# EAGLE design CarelessWISPer_alphaPCB (EAGLE 9.6.2)

## Sheet 1 of 2
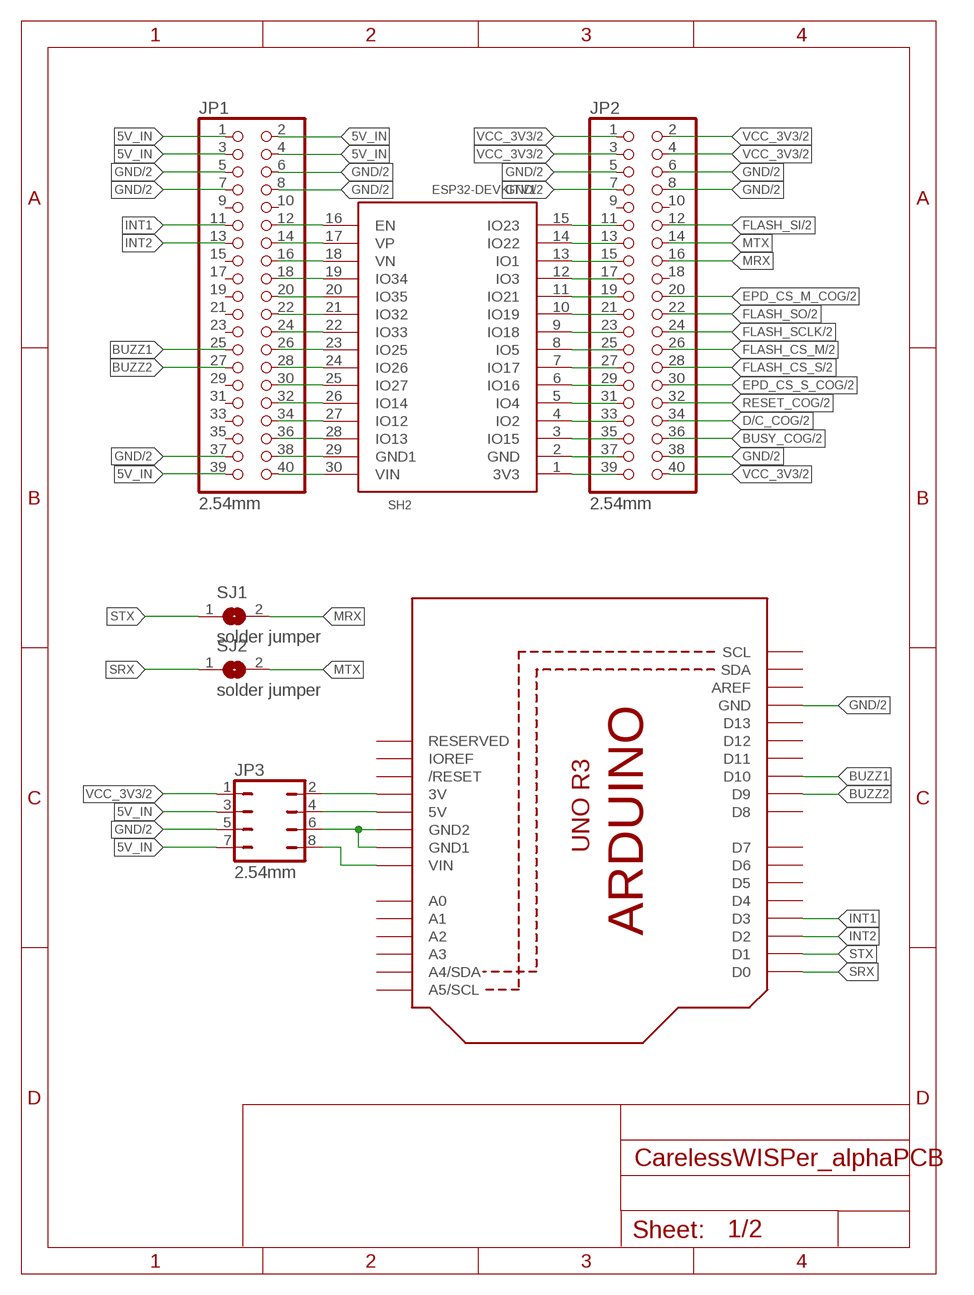
[diagram p0: schematic, sheet 1]

### Parts
JP1  2.54mm  PINHD-2X20  [2X20]
JP2  2.54mm  PINHD-2X20  [2X20]
JP3  2.54mm  JP4Q  [JP4Q]
SH1  ARDUINOR3-BPLACE  [ARDUINOR3-BPLACE]
SH2  ESP32-DEVKIT1_FIX  [ESP32-DEVKITV1]
SJ1  solder jumper  SJ  [SJ]
SJ2  solder jumper  SJ  [SJ]

### Nets
3V [power]: JP3.2 SH1.3V
5V [power]: JP3.4 SH1.5V
5V_IN [power]: JP1.1 JP1.2 JP1.3 JP1.4 JP1.39 JP3.3 JP3.7
BUSY_COG: JP2.36 ; also sheet 2
BUZZ1: JP1.25 SH1.D10
BUZZ2: JP1.27 SH1.D9
D/C_COG: JP2.34 ; also sheet 2
EPD_CS_M_COG: JP2.20 ; also sheet 2
EPD_CS_S_COG: JP2.30 ; also sheet 2
FLASH_CS_M: JP2.26 ; also sheet 2
FLASH_CS_S: JP2.28 ; also sheet 2
FLASH_SCLK: JP2.24 ; also sheet 2
FLASH_SI: JP2.12 ; also sheet 2
FLASH_SO: JP2.22 ; also sheet 2
GND [power]: JP1.5 JP1.6 JP1.7 JP1.8 JP1.37 JP2.5 JP2.6 JP2.7 JP2.8 JP2.38 JP3.5 SH1.GND ; also sheet 2
GND1 [power]: JP1.38 SH2.29(GND1)
GND2 [power]: JP3.6 SH1.GND1 SH1.GND2
INT1: JP1.11 SH1.D3
INT2: JP1.13 SH1.D2
IO1: JP2.15 SH2.13(IO1)
IO2: JP2.33 SH2.4(IO2)
IO3: JP2.17 SH2.12(IO3)
IO3V3 [power]: JP2.39 SH2.1(3V3)
IO4: JP2.31 SH2.5(IO4)
IO5: JP2.25 SH2.8(IO5)
IO12: JP1.34 SH2.27(IO12)
IO13: JP1.36 SH2.28(IO13)
IO14: JP1.32 SH2.26(IO14)
IO15: JP2.35 SH2.3(IO15)
IO16: JP2.29 SH2.6(IO16)
IO17: JP2.27 SH2.7(IO17)
IO18: JP2.23 SH2.9(IO18)
IO19: JP2.21 SH2.10(IO19)
IO21: JP2.19 SH2.11(IO21)
IO22: JP2.13 SH2.14(IO22)
IO23: JP2.11 SH2.15(IO23)
IO25: JP1.26 SH2.23(IO25)
IO26: JP1.28 SH2.24(IO26)
IO27: JP1.30 SH2.25(IO27)
IO32: JP1.22 SH2.21(IO32)
IO33: JP1.24 SH2.22(IO33)
IO34: JP1.18 SH2.19(IO34)
IO35: JP1.20 SH2.20(IO35)
IOEN: JP1.12 SH2.16(EN)
IOGND [power]: JP2.37 SH2.2(GND)
IOVIN [power]: JP1.40 SH2.30(VIN)
IOVN: JP1.16 SH2.18(VN)
IOVP: JP1.14 SH2.17(VP)
MRX: JP2.16 SJ1.2
MTX: JP2.14 SJ2.2
RESET_COG: JP2.32 ; also sheet 2
SRX: SH1.D0 SJ2.1
STX: SH1.D1 SJ1.1
VCC_3V3 [power]: JP2.1 JP2.2 JP2.3 JP2.4 JP2.40 JP3.1 ; also sheet 2
VIN [power]: JP3.8 SH1.VIN
Unconnected: JP1.9 JP1.10 JP1.15 JP1.17 JP1.19 JP1.21 JP1.23 JP1.29 JP1.31 JP1.33 JP1.35 JP2.9 JP2.10 JP2.18 SH1.A0 SH1.A1 SH1.A2 SH1.A3 SH1.A4(A4/SDA) SH1.A5(A5/SCL) SH1.AREF SH1.D4 SH1.D5 SH1.D6 SH1.D7 SH1.D8 SH1.D11 SH1.D12 SH1.D13 SH1.IOREF SH1.RESERVED SH1.RESET(/RESET) SH1.SCL SH1.SDA

## Sheet 2 of 2
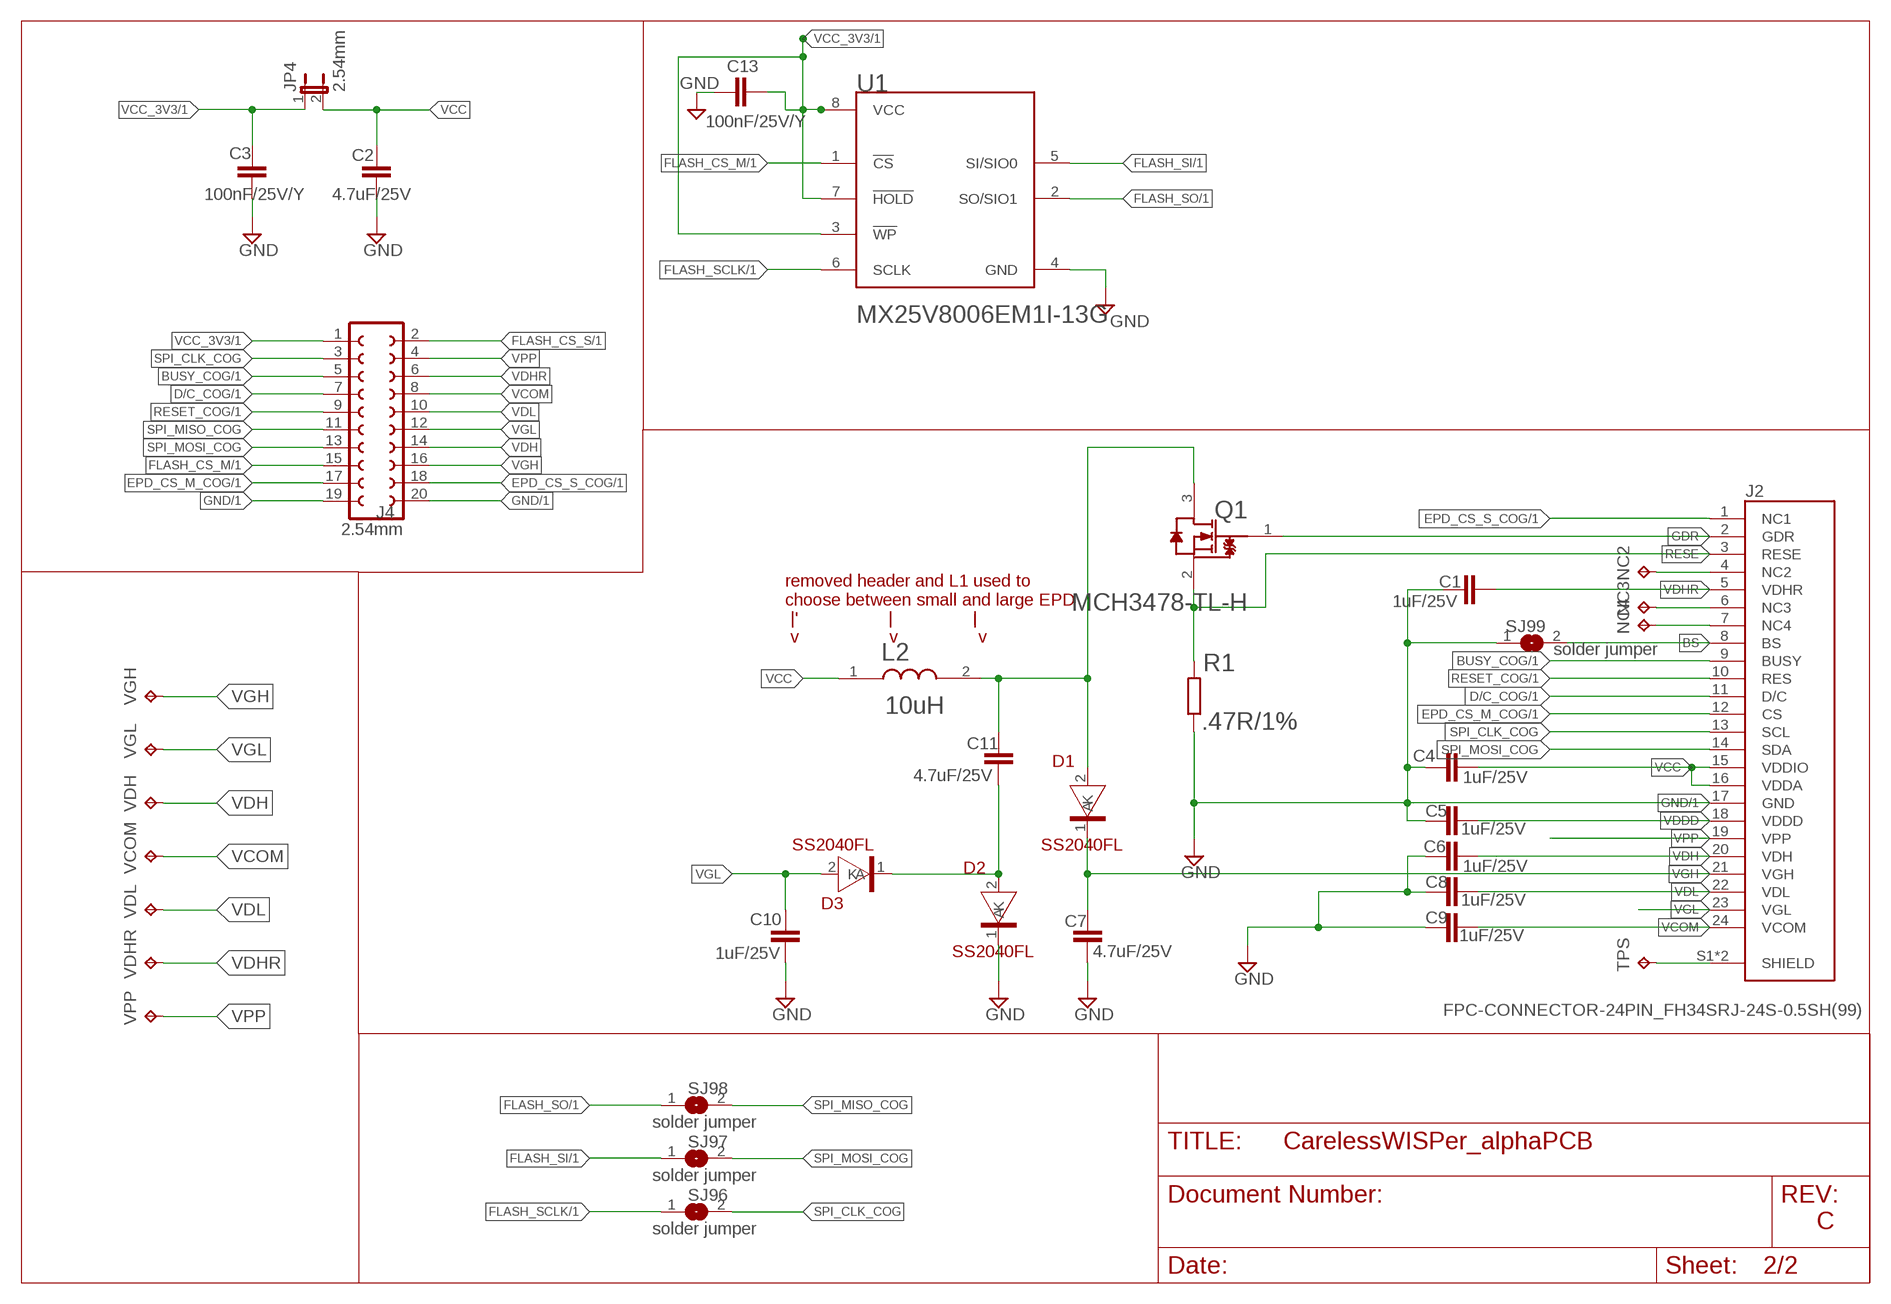
[diagram p1: schematic, sheet 2]

### Parts
C1  1uF/25V  C_CHIP-0805(2012-METRIC)  [CAPC2012X110]
C2  4.7uF/25V  C_CHIP-0805(2012-METRIC)  [CAPC2012X110]
C3  100nF/25V/Y  C_CHIP-0805(2012-METRIC)  [CAPC2012X110]
C4  1uF/25V  C_CHIP-0805(2012-METRIC)  [CAPC2012X110]
C5  1uF/25V  C_CHIP-0805(2012-METRIC)  [CAPC2012X110]
C6  1uF/25V  C_CHIP-0805(2012-METRIC)  [CAPC2012X110]
C7  4.7uF/25V  C_CHIP-0805(2012-METRIC)  [CAPC2012X110]
C8  1uF/25V  C_CHIP-0805(2012-METRIC)  [CAPC2012X110]
C9  1uF/25V  C_CHIP-0805(2012-METRIC)  [CAPC2012X110]
C10  1uF/25V  C_CHIP-0805(2012-METRIC)  [CAPC2012X110]
C11  4.7uF/25V  C_CHIP-0805(2012-METRIC)  [CAPC2012X110]
C13  100nF/25V/Y  C_CHIP-0805(2012-METRIC)  [CAPC2012X110]
D1  SS2040FL  [SOD-123FL]
D2  SS2040FL  [SOD-123FL]
D3  SS2040FL  [SOD-123FL]
J2  FPC-CONNECTOR-24PIN_FH34SRJ-24S-0.5SH(99)  [FPC-CONNECTOR-24PIN_HRS_FH34SRJ-24S-0.5SH(99)]
J4  2.54mm  FE10-2W  [FE10-2W]
JP4  2.54mm  JP1E  [JP1]
L2  MURATA_LQH3NPZ100MMELMURATA_LQH3NPZ100MMEL_0_0  [MURATA_LQH3NPZ100MMEL_0]
NC2  TPB1,27  [B1,27]
NC3  TPB1,27  [B1,27]
NC4  TPB1,27  [B1,27]
Q1  ON_SEMICONDUCTOR_MCH3478-TL-HON_SEMICONDUCTOR_MCH3478-TL-H_0_0  [ON_SEMICONDUCTOR_MCH3478-TL-H_0]
R1  .47R/1%  R_CHIP-0805(2012-METRIC)  [RESC2012X65]
SJ96  solder jumper  SJ  [SJ]
SJ97  solder jumper  SJ  [SJ]
SJ98  solder jumper  SJ  [SJ]
SJ99  solder jumper  SJ  [SJ]
TPS  TPB1,27  [B1,27]
U1  MACRONIX_MX25V8006EM1I-13GMACRONIX_MX25V8006EM1I-13G_0_0  [MACRONIX_MX25V8006EM1I-13G_0]
VCOM  TPB1,27  [B1,27]
VDH  TPB1,27  [B1,27]
VDHR  TPB1,27  [B1,27]
VDL  TPB1,27  [B1,27]
VGH  TPB1,27  [B1,27]
VGL  TPB1,27  [B1,27]
VPP  TPB1,27  [B1,27]

### Nets
BS: J2.8(BS) SJ99.2
BUSY_COG: J2.9(BUSY) J4.5 ; also sheet 1
D/C_COG: J2.11(D/C) J4.7 ; also sheet 1
DIODE_JUNCT: C11.1 D2.2(A) D3.1(K)
EPD_CS_M_COG: J2.12(CS) J4.17 ; also sheet 1
EPD_CS_S_COG: J2.1(NC1) J4.18 ; also sheet 1
FLASH_CS_M: J4.15 U1.1(!CS!) ; also sheet 1
FLASH_CS_S: J4.2 ; also sheet 1
FLASH_SCLK: SJ96.1 U1.6(SCLK) ; also sheet 1
FLASH_SI: SJ97.1 U1.5(SI/SIO0) ; also sheet 1
FLASH_SO: SJ98.1 U1.2(SO/SIO1) ; also sheet 1
GDR [power]: J2.2(GDR) Q1.1(G)
GND [power]: C1.1 C2.1 C3.1 C4.2 C5.2 C6.2 C7.1 C8.2 C9.2 C10.2 C13.1 D2.1(K) J2.17(GND) J4.19 J4.20 R1.1 SJ99.1 U1.4(GND) ; also sheet 1
L2-Q1 [power]: C11.2 D1.2(A) L2.2 Q1.3(D)
NC1: J2.S1(SHIELD) J2.S2(SHIELD) TPS.TP
NC2: J2.4(NC2) NC2.TP
NC3: J2.6(NC3) NC3.TP
NC4: J2.7(NC4) NC4.TP
RESE: J2.3(RESE) Q1.2(S) R1.2
RESET_COG: J2.10(RES) J4.9 ; also sheet 1
SPI_CLK_COG: J2.13(SCL) J4.3 SJ96.2
SPI_MISO_COG: J4.11 SJ98.2
SPI_MOSI_COG: J2.14(SDA) J4.13 SJ97.2
VCC [power]: C2.2 C4.1 J2.15(VDDIO) J2.16(VDDA) JP4.2 L2.1
VCC_3V3 [power]: C3.2 C13.2 J4.1 JP4.1 U1.3(!WP!) U1.7(!HOLD!) U1.8(VCC) ; also sheet 1
VCOM [power]: C9.1 J2.24(VCOM) J4.8 VCOM.TP
VDDD [power]: C5.1 J2.18(VDDD)
VDH [power]: C6.1 J2.20(VDH) J4.14 VDH.TP
VDHR [power]: C1.2 J2.5(VDHR) J4.6 VDHR.TP
VDL [power]: C8.1 J2.22(VDL) J4.10 VDL.TP
VGH [power]: C7.2 D1.1(K) J2.21(VGH) J4.16 VGH.TP
VGL [power]: C10.1 D3.2(A) J2.23(VGL) J4.12 VGL.TP
VPP [power]: J2.19(VPP) J4.4 VPP.TP

### Notes on the sheet
- removed header and L1 used to 
  choose between small and large EPD
   |'                  |                |
   v                  v                v
- C

## Library data of the parts
C1-C11 C13 = Capacitor:C: Capacitor - Generic; CATEGORY: Capacitor
D1-D3 = DIODE:SS2040FL: Check prices <https://pricing.snapeda.com/parts/SS2040FL/Panjit/view-part?ref=eda>; AVAILABILITY: In Stock; DESCRIPTION: Schottky Diodes & Rectifiers GP/TR/13/RoHS/10K/SOD-123FL/SKY/SOD/SSM-20AAFL/SSM20FL-QI02/PJ///; MF: Panjit; MP: SS2040FL; PACKAGE: None; PRICE: None; PURCHASE-URL: https://pricing.snapeda.com/search/part/SS2040FL/?ref=eda
J2 = ESL:FPC-CONNECTOR-24PIN_FH34SRJ-24S-0.5SH(99): FFC & FPC Connectors Check prices <https://pricing.snapeda.com/parts/FH34SRJ-24S-0.5SH%2899%29/Hirose%20Electric/view-part?ref=eda>; AVAILABILITY: In Stock; DESCRIPTION: 24 Position FFC, FPC Connector Contacts, Top and Bottom 0.020 (0.50mm) Surface Mount, Right Angle; MF: Hirose Electric; MP: FH34SRJ-24S-0.5SH(99); PACKAGE: None; PRICE: None; PURCHASE-URL: https://pricing.snapeda.com/search/part/FH34SRJ-24S-0.5SH(99)/?ref=eda
J4 = con-lsta:FE10-2W: FEMALE HEADER; OC_FARNELL: unknown; OC_NEWARK: unknown
JP1 JP2 = pinhead:PINHD-2X20: PIN HEADER
JP3 = jumper:JP4Q: JUMPER
JP4 = jumper:JP1E: JUMPER
L2 = IND 10uH:MURATA_LQH3NPZ100MMEL: Wire Wound Ferrite Inductor for Power Lines For Automotive 10μH ±20% 0.228Ω 1280mA 1212; AMBIENT_TEMPERATURE_RANGE_HIGH: +105°C; AMBIENT_TEMPERATURE_RANGE_LOW: -40°C; AUTOMOTIVE: Yes; AUTOMOTIVE_GRADE: Grade 1; CENTROID_NOT_SPECIFIED: No; COMPOSITION: Wirewound; CORE_MATERIAL: Ferrite; DATASHEET: https://www.murata.com/en-us/products/productdetail?partno=LQH3NPZ100MME%23; DEVICE_CLASS_L1: Passive Components; DEVICE_CLASS_L2: Inductors; DEVICE_CLASS_L3: Fixed Inductors; FOOTPRINT_VARIANT_NAME_0: Recommended_Land_Pattern; HEIGHT: 1.5mm; INDUCTANCE: 10uH; LEAD_FREE: Yes; MF: Murata; MFG_PACKAGE_IDENT: LQH3NPH_ME; MFG_PACKAGE_IDENT_COMPONENT_ID: a63315cd171c542c; MFG_PACKAGE_IDENT_DATE: 0; MFG_PACKAGE_IDENT_REV: 0; MPN: LQH3NPZ100MMEL; PACKAGE: 1212.0; PREFIX: L; RMS_CURRENT: 1280mA; ROHS: Yes; SATURATION_CURRENT: 810mA; SELF_RESONANT_FREQUENCY: 20MHz; SERIES_RESISTANCE: 0.228Ω; SHIELDING: true; TEMPERATURE_RANGE_HIGH: +125°C; TEMPERATURE_RANGE_LOW: -40°C; TEST_FREQUENCY: 1MHz; TOLERANCE: 0.2; VERIFICATION_VERSION: 0.0.0.3
NC2-NC4 TPS VCOM VDH VDHR VDL VGH VGL VPP = testpad:TP: Test pad
Q1 = MOSFET:ON_SEMICONDUCTOR_MCH3478-TL-H: ONSC-NMOS-G1S2D3-3_J; CHANNEL_POLARITY: N Channel; CIIVA_IDS: 837008; CISS_TYP_PF: 130; COMPONENT_LINK_1_DESCRIPTION: Manufacturer URL; COMPONENT_LINK_1_URL: http://www.onsemi.com/; COMPONENT_LINK_3_DESCRIPTION: Package Specification; COMPONENT_LINK_3_URL: http://www.onsemi.com/pub_link/Collateral/EN7354-D.PDF; CONFIGURATION: Single; COSS_TYP_PF: 21; CRSS_TYP_PF: 14; DATASHEET: http://www.onsemi.cn/pub_link/Collateral/ENAA1353-D.PDF; FOOTPRINT_VARIANT_NAME_0: Manufacturer Recommended; IMPORTED: yes; IMPORTED_FROM: vault; IMPORT_TS: 1521851194; MF: On Semiconductor; MOUNTING_TECHNOLOGY: Surface Mount; MPN: MCH3478-TL-H; PACKAGE: MCPH-3; PACKAGE_DESCRIPTION: 3-Pin Small Outline Transistor, Body 2 x 1.6 mm, Pitch 0.65 mm; PACKAGE_TYPE: SC-70FL / MCPH-3; PACKING: Tape and Reel; PREFIX: Q; RELEASE_DATE: 1407149804; ROHS: No; VAULT_GUID: 93CF8D5F-116E-4A84-9C4D-567819B75567; VAULT_REVISION: 4F433114-B412-42D1-93FA-4D10C81BF666; VBRDSS_MIN_V: 30; VGSTH_MAX_V: 1.3; VGS_MAX_V: 12
R1 = Resistor:R: Resistor Fixed - Generic; CATEGORY: Resistor; SUB-CATEGORY: Fixed
SH1 = adafruit:ARDUINOR3: This is a new object for the new Arduino R3 - with extra pins that you may want to use (such as IOref, and duplicated A4/A5
SH2 = ESP32-DEVKITV1_fix:ESP32-DEVKIT1_FIX
SJ1 SJ2 SJ96-SJ99 = jumper:SJ: SMD solder JUMPER
U1 = Flash Memory:MACRONIX_MX25V8006EM1I-13G: FLASH - NOR Memory IC 8Mb (1M x 8) SPI 75MHz 8-SOP; 3DS_PART_NUMBER: 521-00003; ACCESS_TIME: 9us; AMBIENT_TEMPERATURE_RANGE_HIGH: +85°C; AMBIENT_TEMPERATURE_RANGE_LOW: -40°C; CENTROID_NOT_SPECIFIED: No; DATASHEET: https://media.digikey.com/pdf/Data%20Sheets/Macronix/MX25V8006E.pdf; DEVICE_CLASS_L1: Integrated Circuits (ICs); DEVICE_CLASS_L2: Memory; DEVICE_CLASS_L3: Flash; DIGIKEY_DESCRIPTION: IC FLASH 8MBIT 75MHZ 8SOP; DIGIKEY_PART_NUMBER: 1092-1118-ND; FOOTPRINT_PARAMETERS_0: {"fp_type":"SOIC_mini","params":{"N":{"nom":8,"long name":"Number of leads","min":null,"max":null,"short name":"N","type":"count"},"A":{"nom":false,"long name":"Height","min":false,"max":1750000,"short name":"A","type":"measurement"},"A1":{"nom":150000,"long name":"Package clearance","min":100000,"max":200000,"short name":"A1","type":"measurement"},"A2":{"nom":1450000,"long name":"Package height","min":1350000,"max":1550000,"short name":"A2","type":"measurement"},"D":{"nom":4900000,"long name":"Package length","min":4770000,"max":5030000,"short name":"D","type":"measurement"},"E":{"nom":5990000,"long name":"Width w/ leads","min":5800000,"max":6200000,"short name":"E","type":"measurement"},"E1":{"nom":3900000,"long name":"Package width","min":3800000,"max":4000000,"short name":"E1","type":"measurement"},"B":{"nom":410000,"long name":"Lead width","min":360000,"max":510000,"short name":"B","type":"measurement"},"C":{"nom":200000,"long name":"Lead thickness","min":150000,"max":250000,"short name":"C","type":"measurement"},"e":{"nom":1270000,"long name":"Lead pitch","min":null,"max":null,"short name":"e","type":"measurement"},"L":{"nom":660000,"long name":"Lead foot length","min":460000,"max":860000,"short name":"L","type":"measurement"},"PHI":{"nom":5,"long name":"Lead foot angle","min":0,"max":8,"short name":"PHI","type":"measurement"},"HT":{"default":"No","long name":"Thermal pad","type":"multichoiceparent","short name":"HT","children":[]},"offset x":{"nom":0,"long name":"X Center offset","min":null,"max":null,"short name":"offset x","type":"measurement"},"offset y":{"nom":0,"long name":"Y Center offset","min":null,"max":null,"short name":"offset y","type":"measurement"},"LS":{"default":"Rounded rectangle","long name":"Land shape","type":"multichoice","short name":"LS"},"LS1":{"default":"Rectangle","long name":"Land shape (Pin 1)","type":"multichoice","short name":"LS1"},"solder toe":{"nom":550000,"long name":"Solder fillet (toe)","min":null,"max":null,"short name":"solder toe","type":"fixedmeasurement"},"solder heel":{"nom":450000,"long name":"Solder fillet (heel)","min":null,"max":null,"short name":"solder heel","type":"fixedmeasurement"},"solder side":{"nom":50000,"long name":"Solder fillet (side)","min":null,"max":null,"short name":"solder side","type":"fixedmeasurement"},"courtyard":{"nom":500000,"long name":"Courtyard","min":null,"max":null,"short name":"courtyard","type":"fixedmeasurement"},"SF":{"default":"A","long name":"Packing level","type":"multichoiceparent","short name":"SF","help":"http://support.upverter.com/customer/portal/articles/978783-what-is-a-footprint-packing-level","children":["solder toe","solder heel","solder side","courtyard"]}}}; FOOTPRINT_PARAMETERS_1: {"fp_type":"SOIC_mini","params":{"N":{"nom":8,"long name":"Number of leads","min":null,"max":null,"short name":"N","type":"count"},"A":{"nom":false,"long name":"Height","min":false,"max":1750000,"short name":"A","type":"measurement"},"A1":{"nom":150000,"long name":"Package clearance","min":100000,"max":200000,"short name":"A1","type":"measurement"},"A2":{"nom":1450000,"long name":"Package height","min":1350000,"max":1550000,"short name":"A2","type":"measurement"},"D":{"nom":4900000,"long name":"Package length","min":4770000,"max":5030000,"short name":"D","type":"measurement"},"E":{"nom":5990000,"long name":"Width w/ leads","min":5800000,"max":6200000,"short name":"E","type":"measurement"},"E1":{"nom":3900000,"long name":"Package width","min":3800000,"max":4000000,"short name":"E1","type":"measurement"},"B":{"nom":410000,"long name":"Lead width","min":360000,"max":510000,"short name":"B","type":"measurement"},"C":{"nom":200000,"long name":"Lead thickness","min":150000,"max":250000,"short name":"C","type":"measurement"},"e":{"nom":1270000,"long name":"Lead pitch","min":null,"max":null,"short name":"e","type":"measurement"},"L":{"nom":660000,"long name":"Lead foot length","min":460000,"max":860000,"short name":"L","type":"measurement"},"PHI":{"nom":5,"long name":"Lead foot angle","min":0,"max":8,"short name":"PHI","type":"measurement"},"HT":{"default":"No","long name":"Thermal pad","type":"multichoiceparent","short name":"HT","children":[]},"offset x":{"nom":0,"long name":"X Center offset","min":null,"max":null,"short name":"offset x","type":"measurement"},"offset y":{"nom":0,"long name":"Y Center offset","min":null,"max":null,"short name":"offset y","type":"measurement"},"LS":{"default":"Rounded rectangle","long name":"Land shape","type":"multichoice","short name":"LS"},"LS1":{"default":"Rectangle","long name":"Land shape (Pin 1)","type":"multichoice","short name":"LS1"},"solder toe":{"nom":350000,"long name":"Solder fillet (toe)","min":null,"max":null,"short name":"solder toe","type":"fixedmeasurement"},"solder heel":{"nom":350000,"long name":"Solder fillet (heel)","min":null,"max":null,"short name":"solder heel","type":"fixedmeasurement"},"solder side":{"nom":30000,"long name":"Solder fillet (side)","min":null,"max":null,"short name":"solder side","type":"fixedmeasurement"},"courtyard":{"nom":250000,"long name":"Courtyard","min":null,"max":null,"short name":"courtyard","type":"fixedmeasurement"},"SF":{"default":"B","long name":"Packing level","type":"multichoiceparent","short name":"SF","help":"http://support.upverter.com/customer/portal/articles/978783-what-is-a-footprint-packing-level","children":["solder toe","solder heel","solder side","courtyard"]}}}; FOOTPRINT_PARAMETERS_2: {"fp_type":"SOIC_mini","params":{"N":{"nom":8,"long name":"Number of leads","min":null,"max":null,"short name":"N","type":"count"},"A":{"nom":false,"long name":"Height","min":false,"max":1750000,"short name":"A","type":"measurement"},"A1":{"nom":150000,"long name":"Package clearance","min":100000,"max":200000,"short name":"A1","type":"measurement"},"A2":{"nom":1450000,"long name":"Package height","min":1350000,"max":1550000,"short name":"A2","type":"measurement"},"D":{"nom":4900000,"long name":"Package length","min":4770000,"max":5030000,"short name":"D","type":"measurement"},"E":{"nom":5990000,"long name":"Width w/ leads","min":5800000,"max":6200000,"short name":"E","type":"measurement"},"E1":{"nom":3900000,"long name":"Package width","min":3800000,"max":4000000,"short name":"E1","type":"measurement"},"B":{"nom":410000,"long name":"Lead width","min":360000,"max":510000,"short name":"B","type":"measurement"},"C":{"nom":200000,"long name":"Lead thickness","min":150000,"max":250000,"short name":"C","type":"measurement"},"e":{"nom":1270000,"long name":"Lead pitch","min":null,"max":null,"short name":"e","type":"measurement"},"L":{"nom":660000,"long name":"Lead foot length","min":460000,"max":860000,"short name":"L","type":"measurement"},"PHI":{"nom":5,"long name":"Lead foot angle","min":0,"max":8,"short name":"PHI","type":"measurement"},"HT":{"default":"No","long name":"Thermal pad","type":"multichoiceparent","short name":"HT","children":[]},"offset x":{"nom":0,"long name":"X Center offset","min":null,"max":null,"short name":"offset x","type":"measurement"},"offset y":{"nom":0,"long name":"Y Center offset","min":null,"max":null,"short name":"offset y","type":"measurement"},"LS":{"default":"Rounded rectangle","long name":"Land shape","type":"multichoice","short name":"LS"},"LS1":{"default":"Rectangle","long name":"Land shape (Pin 1)","type":"multichoice","short name":"LS1"},"solder toe":{"nom":150000,"long name":"Solder fillet (toe)","min":null,"max":null,"short name":"solder toe","type":"fixedmeasurement"},"solder heel":{"nom":250000,"long name":"Solder fillet (heel)","min":null,"max":null,"short name":"solder heel","type":"fixedmeasurement"},"solder side":{"nom":10000,"long name":"Solder fillet (side)","min":null,"max":null,"short name":"solder side","type":"fixedmeasurement"},"courtyard":{"nom":100000,"long name":"Courtyard","min":null,"max":null,"short name":"courtyard","type":"fixedmeasurement"},"SF":{"default":"C","long name":"Packing level","type":"multichoiceparent","short name":"SF","help":"http://support.upverter.com/customer/portal/articles/978783-what-is-a-footprint-packing-level","children":["solder toe","solder heel","solder side","courtyard"]}}}; FOOTPRINT_URL: http://www.macronix.com/Lists/ApplicationNote/Attachments/1897/AN0239V1%20-%20Macronix%20150mil%208SOP_6x5mm8WSON_dual%20layout.pdf; FOOTPRINT_VARIANT_NAME_0: IPC_A; FOOTPRINT_VARIANT_NAME_1: IPC_B; FOOTPRINT_VARIANT_NAME_2: IPC_C; FOOTPRINT_VARIANT_NAME_3: Recommended_Land_Pattern; FREQUENCY: 75MHz; HEIGHT: 1.75mm; INTERFACE: SPI; IPC_LAND_PATTERN_NAME: SOIC127P599X175-8; LEAD_FREE: yes; MAX_SUPPLY_VOLTAGE: 3.6V; MEMORY_SIZE: 8MB; MEMORY_TYPE: FLASH; MF: Macronix; MFG_PACKAGE_IDENT: SOP-8; MFG_PACKAGE_IDENT_DATE: 11-26-03; MFG_PACKAGE_IDENT_REV: 6; MIN_SUPPLY_VOLTAGE: 2.35V; MPN: MX25V8006EM1I-13G; NOMINAL_SUPPLY_CURRENT: 12mA; PACKAGE: SOP8; PREFIX: U; ROHS: yes; STANDOFF_HEIGHT: 0.15mm; TEMPERATURE_RANGE_HIGH: +85°C; TEMPERATURE_RANGE_LOW: -40°C

## Net classes
1 power: width 0.305 mm

## Board
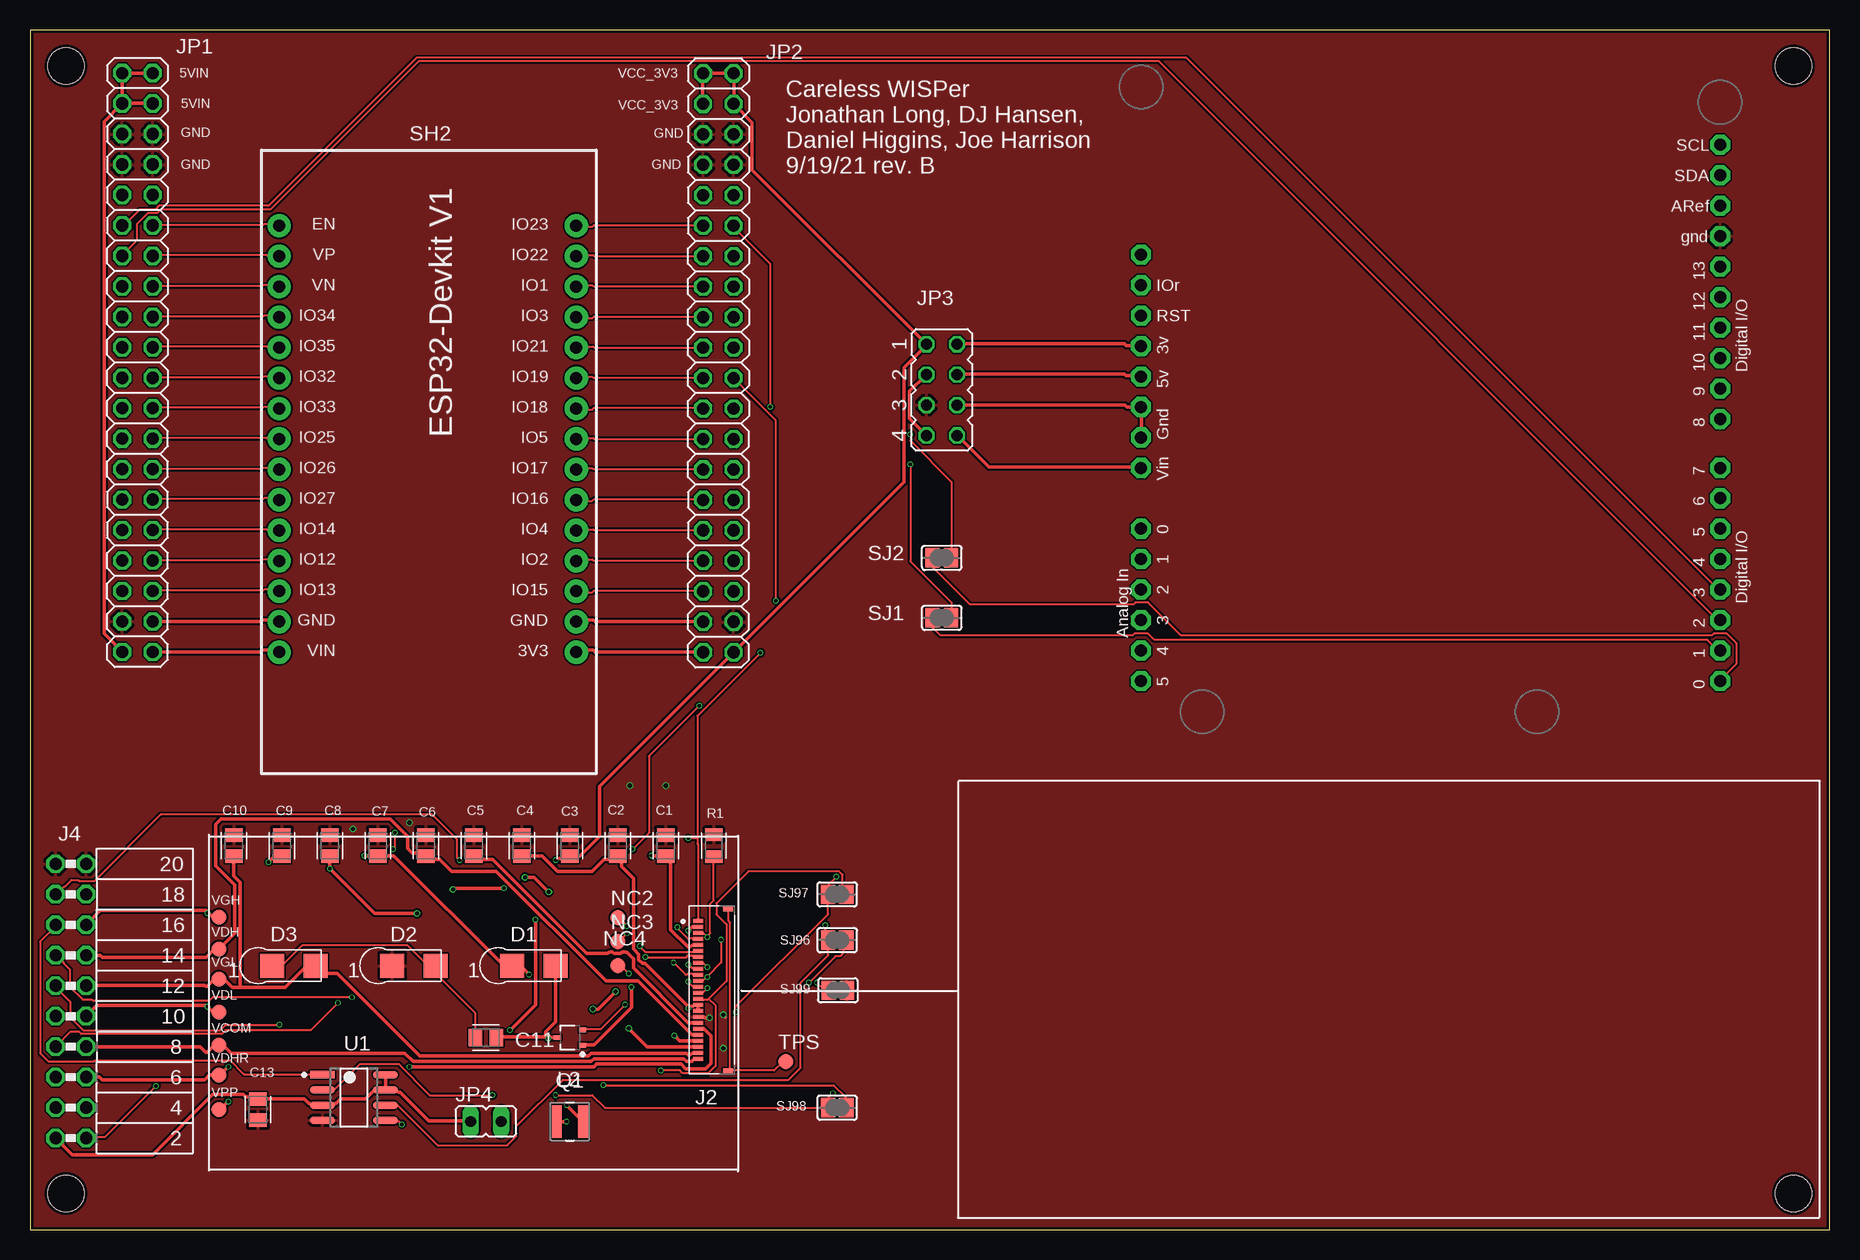
[diagram p2: board, top side]
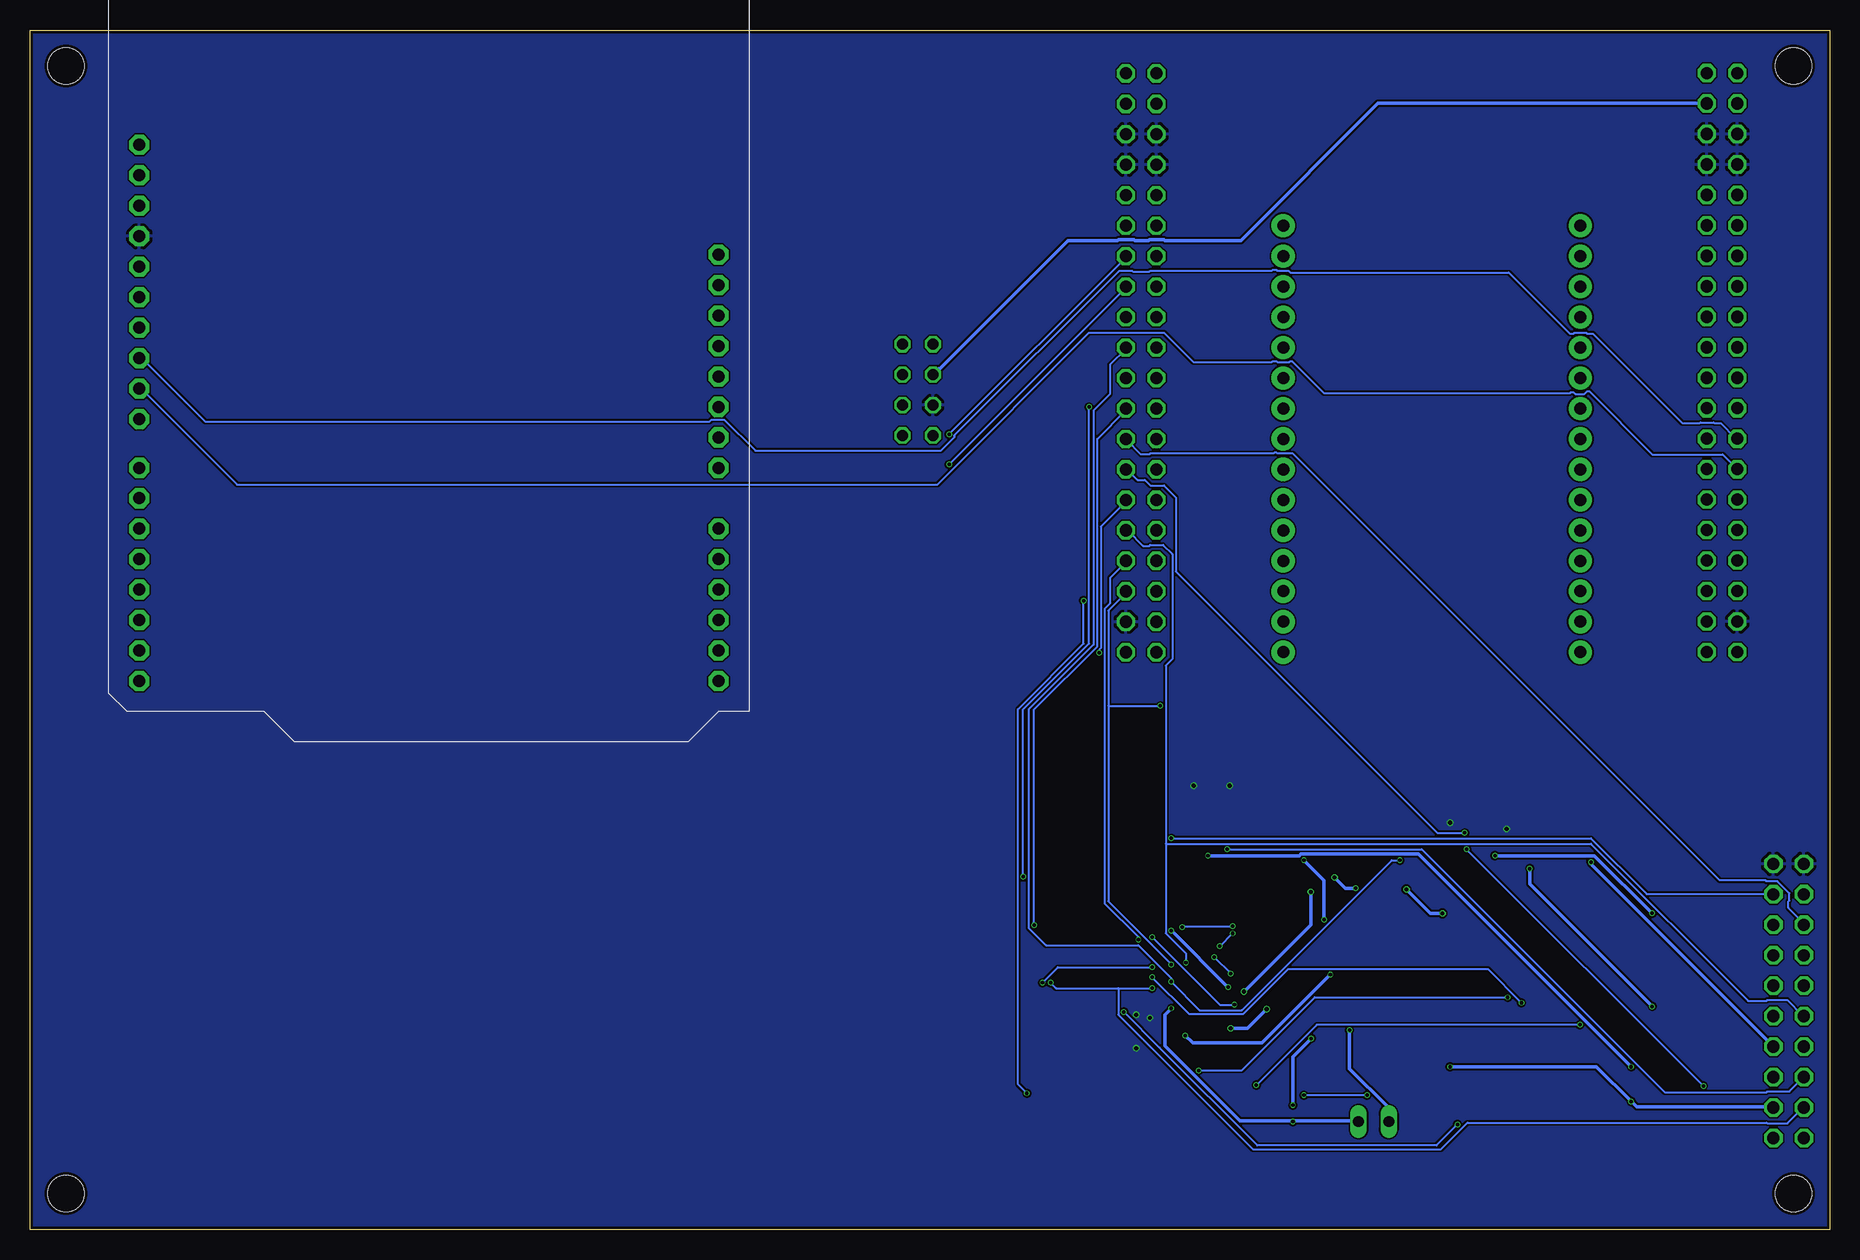
[diagram p3: board, bottom side, seen from below]

Size 150 x 100 mm. Coordinates in mm from the lower left corner, seen from the top.
Outline: 0,0 150,0 150,100 0,100 0,0
Copper layers (1*16): Top 0.035mm / dielectric 1.5mm / Bottom 0.035mm
Design rules "EagleRules-2-Layer-Shep-C": minimum track width 6mil, minimum drill 0.3mm, track to track 6mil, track to pad 6mil, pad to pad 6mil, via to via 6mil, smd to smd 0mil, copper to edge 10mil, drill to drill 10mil, minimum pad ring 2mil, minimum via ring 2mil, stop-mask expansion 2mil, vias tented up to drill 100mil, thermal gap 10mil
Holes 3 mm at 3,3 147,3 147,97 3,97

### Footprints (pad centres in the part's own frame; a part is rotated, then mirrored left to right if it is on the bottom)
CAPC2012X110 = smd 1.165 x 1.465: 1 -0.875,0; 2 0.875,0
SOD-123FL = smd 2 x 2: 1 -1.8,0; 2 1.8,0
FPC-CONNECTOR-24PIN_HRS_FH34SRJ-24S-0.5SH(99) = smd 0.3 x 0.8: 1 5.75,1.15; 2 5.25,1.15; 3 4.75,1.15; 4 4.25,1.15; 5 3.75,1.15; 6 3.25,1.15; 7 2.75,1.15; 8 2.25,1.15; 9 1.75,1.15; 10 1.25,1.15; 11 0.75,1.15; 12 0.25,1.15; 13 -0.25,1.15; 14 -0.75,1.15; 15 -1.25,1.15; 16 -1.75,1.15; 17 -2.25,1.15; 18 -2.75,1.15; 19 -3.25,1.15; 20 -3.75,1.15; 21 -4.25,1.15; 22 -4.75,1.15; 23 -5.25,1.15; 24 -5.75,1.15 | smd 0.4 x 0.8: S1 -6.75,-1.35; S2 6.75,-1.35
FE10-2W = drill 1.016 octagon: 1 -11.43,1.27; 2 -11.43,-1.27; 3 -8.89,1.27; 4 -8.89,-1.27; 5 -6.35,1.27; 6 -6.35,-1.27; 7 -3.81,1.27; 8 -3.81,-1.27; 9 -1.27,1.27; 10 -1.27,-1.27; 11 1.27,1.27; 12 1.27,-1.27; 13 3.81,1.27; 14 3.81,-1.27; 15 6.35,1.27; 16 6.35,-1.27; 17 8.89,1.27; 18 8.89,-1.27; 19 11.43,1.27; 20 11.43,-1.27
2X20 = drill 1.016 octagon: 1 -24.13,-1.27; 2 -24.13,1.27; 3 -21.59,-1.27; 4 -21.59,1.27; 5 -19.05,-1.27; 6 -19.05,1.27; 7 -16.51,-1.27; 8 -16.51,1.27; 9 -13.97,-1.27; 10 -13.97,1.27; 11 -11.43,-1.27; 12 -11.43,1.27; 13 -8.89,-1.27; 14 -8.89,1.27; 15 -6.35,-1.27; 16 -6.35,1.27; 17 -3.81,-1.27; 18 -3.81,1.27; 19 -1.27,-1.27; 20 -1.27,1.27; 21 1.27,-1.27; 22 1.27,1.27; 23 3.81,-1.27; 24 3.81,1.27; 25 6.35,-1.27; 26 6.35,1.27; 27 8.89,-1.27; 28 8.89,1.27; 29 11.43,-1.27; 30 11.43,1.27; 31 13.97,-1.27; 32 13.97,1.27; 33 16.51,-1.27; 34 16.51,1.27; 35 19.05,-1.27; 36 19.05,1.27; 37 21.59,-1.27; 38 21.59,1.27; 39 24.13,-1.27; 40 24.13,1.27
JP4Q = drill 0.914 octagon: 1 -3.81,-1.27; 2 -3.81,1.27; 3 -1.27,-1.27; 4 -1.27,1.27; 5 1.27,-1.27; 6 1.27,1.27; 7 3.81,-1.27; 8 3.81,1.27
JP1 = drill 0.914 long: 1 0,-1.27; 2 0,1.27
MURATA_LQH3NPZ100MMEL_0 = smd 0.8 x 2.7: 1 -1.1,0; 2 1.1,0
B1,27 = smd 1.27 x 1.27: TP 0,0
ON_SEMICONDUCTOR_MCH3478-TL-H_0 = smd 0.6 x 0.4: 1 -1.05,0.65; 2 -1.05,-0.65; 3 1.05,0
RESC2012X65 = smd 1.031 x 1.42: 1 -0.919,0; 2 0.919,0
ARDUINOR3-BPLACE = drill 1 pad 1.676 octagon: 3V 35.56,2.54; 5V 38.1,2.54; A0 50.8,2.54; A1 53.34,2.54; A2 55.88,2.54; A3 58.42,2.54; A4 60.96,2.54; A5 63.5,2.54; AREF 23.876,50.8; D0 63.5,50.8; D1 60.96,50.8; D2 58.42,50.8; D3 55.88,50.8; D4 53.34,50.8; D5 50.8,50.8; D6 48.26,50.8; D7 45.72,50.8; D8 41.656,50.8; D9 39.116,50.8; D10 36.576,50.8; D11 34.036,50.8; D12 31.496,50.8; D13 28.956,50.8; GND 26.416,50.8; GND1 43.18,2.54; GND2 40.64,2.54; IOREF 30.48,2.54; RESERVED 27.94,2.54; RESET 33.02,2.54; SCL 18.796,50.8; SDA 21.336,50.8; VIN 45.72,2.54
ESP32-DEVKITV1 = drill 1 pad 1.93: 1 -22.87,-13.54; 2 -20.33,-13.54; 3 -17.79,-13.54; 4 -15.25,-13.54; 5 -12.71,-13.54; 6 -10.17,-13.54; 7 -7.63,-13.54; 8 -5.09,-13.54; 9 -2.55,-13.54; 10 -0.01,-13.54; 11 2.53,-13.54; 12 5.07,-13.54; 13 7.61,-13.54; 14 10.15,-13.54; 15 12.69,-13.54; 16 12.69,11.23; 17 10.15,11.23; 18 7.61,11.23; 19 5.07,11.23; 20 2.53,11.23; 21 -0.01,11.23; 22 -2.55,11.23; 23 -5.09,11.23; 24 -7.63,11.23; 25 -10.17,11.23; 26 -12.71,11.23; 27 -15.25,11.23; 28 -17.79,11.23; 29 -20.33,11.23; 30 -22.87,11.23
SJ = smd 1.168 x 1.6: 1 -0.762,0; 2 0.762,0
MACRONIX_MX25V8006EM1I-13G_0 = smd 2.065 x 0.626: 1 -2.621,1.905; 2 -2.621,0.635; 3 -2.621,-0.635; 4 -2.621,-1.905; 5 2.621,-1.905; 6 2.621,-0.635; 7 2.621,0.635; 8 2.621,1.905

### Placement (x,y rotation side)
C1  53,32 270 top
C2  49,32 270 top
C3  45,32 270 top
C4  41,32 90 top
C5  37,32 90 top
C6  33,32 90 top
C7  29,32 270 top
C8  25,32 90 top
C9  21,32 90 top
C10  17,32 90 top
C11  38,16 0 top
C13  19,10 90 top
D1  42,22 0 top
D2  32,22 0 top
D3  22,22 0 top
J2  56.84,19.98 90 top
J4  3.41,19.06 90 top
JP1  8.96,72.28 270 top
JP2  57.38,72.25 270 top
JP3  76,70 270 top
JP4  38,9 270 top
L2  45,9 0 top
NC2  49,26 0 top
NC3  49,24 0 top
NC4  49,22 0 top
Q1  45,16 180 top
R1  57,32 270 top
SH1  90.08,109.22 270 top
SH2  32,71 90 top
SJ1  76,51 0 top
SJ2  76,56 0 top
SJ96  67.28,24.13 0 top
SJ97  67.28,27.94 0 top
SJ98  67.28,10.16 0 top
SJ99  67.34,19.94 180 top
TPS  63,14 0 top
U1  27,11 0 top
VCOM  15.75,15.38 0 top
VDH  15.75,23.38 0 top
VDHR  15.75,12.87 0 top
VDL  15.75,18.13 0 top
VGH  15.75,26.04 0 top
VGL  15.75,20.87 0 top
VPP  15.75,10 0 top

### Tracks (layer width: path | path; a pad name or v marks a point on that pad's centre or on a via)
3V
  Top 0.305: JP3.2 77.34,73.84 91.21,73.84 91.36,73.69 92.58,73.69 SH1.3V
5V
  Top 0.305: JP3.4 77.34,71.32 91.21,71.32 91.36,71.17 92.58,71.17 SH1.5V
5V_IN
  Top 0.305: JP3.7 74.68,66.22 73.3,67.59 73.3,69.88 74.68,71.25 JP3.3 | JP1.39 7.62,48.16 7.09,48.69 7.09,48.77 6.17,49.68 6.17,92.35 7.62,93.8 JP1.3 | JP1.4 10.21,93.88 7.77,93.88 JP1.3 | JP1.3 7.7,93.95 7.7,96.39 JP1.1 7.85,96.39 10.21,96.39 JP1.2
  Bottom 0.305: JP3.3 74.68,71.32 74.22,71.78 74.14,71.78 63.48,82.45 59.36,82.45 59.28,82.53 57.99,82.53 57.91,82.45 56.77,82.45 56.69,82.53 55.47,82.53 55.4,82.45 49.07,82.45 37.64,93.88 10.29,93.88 JP1.4
BS  (via drill 0.3)
  Top 0.152: v56.46,21.87 56.08,22.25 55.7,22.25 J2.8 | v65.61,20.57 66.22,19.96 66.52,19.96 SJ99.2
  Bottom 0.152: v56.46,21.87 64.31,21.87 v65.61,20.57
BUSY_COG  (via drill 0.3)
  Top 0.152: v54.86,22.1 55.17,21.79 55.63,21.79 J2.9 | v50.22,31.7 51.59,33.07 51.59,39.47 v55.78,43.66
  Bottom 0.152: v54.86,22.1 60.12,27.36 60.12,43.66 | 60.12,43.66 60.12,51.59 58.67,53.03 58.67,53.19 JP2.36 | v50.22,31.7 33.98,31.7 13.72,11.43 5.26,11.43 5.18,11.51 3.35,11.51 2.21,12.65 J4.5 | 60.12,43.66 v55.78,43.66
BUZZ1
  Bottom 0.152: JP1.25 7.7,65.99 7.85,65.99 9.07,67.21 9.6,67.21 9.68,67.28 10.74,67.28 10.82,67.21 12.27,67.21 19.74,74.68 20.19,74.68 20.27,74.75 21.26,74.75 21.34,74.68 21.64,74.68 26.75,79.78 44.96,79.78 45.11,79.93 46.02,79.93 46.1,80.01 46.41,80.01 46.48,79.93 56.62,79.93 56.69,79.86 58.06,79.86 58.14,79.93 59.21,79.93 72.92,66.22 72.92,66.06 74.07,64.92 89.53,64.92 92.13,67.51 93.19,67.51 93.34,67.36 135.41,67.36 140.66,72.62 140.82,72.62 SH1.D10
BUZZ2
  Bottom 0.152: SH1.D9 140.74,70.1 132.74,62.1 74.37,62.1 61.72,74.75 55.47,74.75 53.03,72.31 46.48,72.31 46.41,72.39 46.1,72.39 46.02,72.31 45.03,72.31 44.96,72.39 44.81,72.39 42.14,69.72 21.64,69.72 21.57,69.8 21.34,69.8 21.18,69.65 20.42,69.65 20.19,69.88 20.04,69.88 14.78,64.62 8.91,64.62 JP1.27
D/C_COG  (via drill 0.3)
  Top 0.152: 56.43,21.07 57.61,22.25 v57.61,24.16 | 56.43,21.07 56.08,20.73 55.7,20.73 J2.11 | v25.68,18.9 23.39,16.61 16.31,16.61 16,16.31 4.27,16.31 4.12,16.46 3.35,16.46 2.21,15.32 J4.7 | v56.46,21.03 56.43,21.07
  Bottom 0.152: v57.61,24.16 57.61,24.38 60.43,27.2 60.43,51.74 59.97,52.2 59.97,54.33 58.6,55.7 JP2.34 | v25.68,18.9 28.5,21.72 45.11,21.72 48.84,17.98 53.42,17.98 v56.46,21.03
DIODE_JUNCT
  Top 0.152: C11.1 37.11,18.06 33.83,21.34 33.83,21.95 D2.2 33.76,22.02 33.15,22.02 31.47,23.7 22.71,23.7 21.03,22.02 20.27,22.02 D3.1
EPD_CS_M_COG  (via drill 0.3)
  Top 0.152: v54.86,20.65 55.24,20.27 55.63,20.27 J2.12 | v35.81,30.79 35.59,31.01 35.59,32.54 33.53,34.59 10.9,34.59 5.33,29.03 4.12,29.03 4.04,29.11 3.43,29.11 2.9,28.57 2.82,28.57 2.21,27.96 J4.17
  Bottom 0.152: JP2.20 58.6,73.46 59.97,72.08 59.97,69.65 61.34,68.28 61.34,48.77 66.75,43.36 66.75,25.15 65.3,23.7 57.61,23.7 54.86,20.95 v54.86,20.65 52.5,18.29 49,18.29 36.5,30.79 v35.81,30.79
EPD_CS_S_COG  (via drill 0.3)
  Top 0.152: 55.63,32.61 55.63,42.82 v60.88,48.08 | 55.63,32.61 55.63,32.16 55.7,32.08 55.7,25.76 J2.1 | 55.63,32.61 v54.86,32.61
  Bottom 0.152: v60.88,48.08 60.88,48.31 60.73,48.46 60.73,58.6 58.67,60.66 58.67,60.81 JP2.30 | v54.86,32.61 19.89,32.61 15.24,27.96 4.72,27.96 J4.18
FLASH_CS_M
  Top 0.152: U1.1 24.31,12.95 17.83,12.95 16.69,14.1 5.41,14.1 5.33,14.02 1.52,14.02 0.84,14.71 0.84,24 2.21,25.38 J4.15
  Bottom 0.152: JP2.26 58.6,65.84 57.38,64.62 56.69,64.62 56.62,64.69 46.33,64.69 46.25,64.77 46.1,64.77 46.02,64.69 44.73,64.69 9.14,29.11 5.33,29.11 5.26,29.03 4.34,29.03 3.35,28.04 3.35,27.43 3.43,27.36 3.43,26.82 2.21,25.6 2.21,25.45 J4.15
FLASH_CS_S  (via drill 0.3)
  Top 0.152: v10.52,11.96 6.25,7.7 4.72,7.7 J4.2 | v30.25,31.7 30.4,31.85 v30.4,33.07
  Bottom 0.152: v30.25,31.7 v10.52,11.96 | v30.4,33.07 32.69,33.07 54.48,54.86 54.48,61.04 55.47,62.03 56.62,62.03 57.07,62.48 57.68,62.48 58.6,63.4 JP2.28
FLASH_SCLK  (via drill 0.3)
  Top 0.152: U1.6 29.64,10.36 30.63,10.36 33.98,7.01 39.78,7.01 40.54,7.77 40.54,8.61 44.42,12.5 63.25,12.5 64.24,13.49 64.24,20.57 66.52,22.86 66.52,24.08 SJ96.1 66.45,24.16 66.29,24.31 v66.29,25.38
  Bottom 0.152: v66.29,25.38 66.29,43.36 61.04,48.62 61.04,65.91 58.67,68.28 58.67,68.43 JP2.24
FLASH_SI  (via drill 0.3)
  Top 0.152: v58.83,18.14 58.83,18.59 66.52,26.29 66.52,27.89 SJ97.1 66.52,27.96 66.52,28.73 v67.21,29.41 | v31.01,8.76 30.79,8.99 30.71,8.99 30.63,9.07 29.64,9.07 U1.5 | v61.72,68.58 61.72,80.47 58.67,83.52 58.67,83.67 JP2.12
  Bottom 0.152: v58.83,18.14 55.84,15.15 47.7,7.01 32.77,7.01 v31.01,8.76 | v61.72,68.58 61.72,48.84 67.21,43.36 v67.21,29.41
FLASH_SO  (via drill 0.3)
  Top 0.152: v43.81,11.2 46.86,11.2 47.93,10.13 66.45,10.13 SJ98.1 66.45,10.21 66.45,10.9 v66.9,11.35 | v38.56,11.2 33.3,11.2 30.71,13.79 27.51,13.79 25.38,11.66 24.38,11.66 U1.2 | v62.18,52.43 62.18,67.44 58.67,70.94 JP2.22
  Bottom 0.152: v38.56,11.2 v43.81,11.2 | v62.18,52.43 62.18,48.84 67.67,43.36 67.67,12.12 v66.9,11.35
GDR  (via drill 0.3)
  Top 0.305: v50.14,20.19 50.14,18.52 47.02,15.39 46.1,15.39 Q1.1 | v54.86,24.92 55.17,25.22 55.63,25.22 J2.2
  Bottom 0.305: v54.86,24.92 v50.14,20.19
GND  (via drill 0.35)
  Top 0.305: v56.64,17.65 56.25,17.65 56.18,17.72 55.7,17.72 J2.17 | v57.78,17.91 57.99,17.7
  other vias: 57.78,15.11 31.62,33.91 26.92,33.4 53,37 50,37
  pour Bottom: -2,101 151,101 151,-1 -2,-1
  pour Top: -4,101 152,101 152,-2 -4,-2
GND1
  Top 0.305: JP1.38 10.29,50.67 19.2,50.67 19.36,50.83 20.57,50.83 20.73,50.67 SH2.29
GND2
  Top 0.305: JP3.6 77.34,68.73 91.29,68.73 91.44,68.58 SH1.GND2 92.66,68.5 92.66,66.06 SH1.GND1
INT1
  Top 0.152: SH1.D3 140.74,53.34 96.39,97.69 32.23,97.69 19.89,85.34 10.74,85.34 10.44,85.04 9.14,85.04 7.85,83.74 7.7,83.74 JP1.11
INT2
  Top 0.152: JP1.13 7.7,81.23 8.91,82.45 8.91,83.82 9.83,84.73 10.59,84.73 10.9,85.04 20.04,85.04 32.38,97.38 94.11,97.38 140.66,50.83 140.82,50.83 SH1.D2
IO1
  Top 0.152: JP2.15 56.08,78.64 46.94,78.64 46.86,78.72 46.56,78.72 46.48,78.64 45.57,78.64 SH2.13
IO2
  Top 0.152: JP2.33 56.08,55.78 46.94,55.78 46.86,55.85 46.56,55.85 46.48,55.78 45.57,55.78 SH2.4
IO3
  Top 0.152: JP2.17 56.08,76.12 47.02,76.12 46.86,75.97 46.56,75.97 46.48,76.05 45.57,76.05 SH2.12
IO3V3
  Top 0.305: JP2.39 56.08,48.16 47.09,48.16 46.94,48.31 46.56,48.31 46.41,48.16 45.57,48.16 SH2.1
IO4
  Top 0.152: JP2.31 56.08,58.29 47.02,58.29 46.94,58.37 46.56,58.37 46.48,58.29 45.57,58.29 SH2.5
IO5
  Top 0.152: JP2.25 56.08,65.91 47.02,65.91 46.94,65.99 46.56,65.99 46.48,65.91 45.57,65.91 SH2.8
IO12
  Top 0.152: JP1.34 10.29,55.78 19.36,55.78 19.43,55.85 20.65,55.85 20.73,55.78 SH2.27
IO13
  Top 0.152: JP1.36 10.29,53.26 19.43,53.26 19.51,53.34 20.65,53.34 20.73,53.26 SH2.28
IO14
  Top 0.152: JP1.32 10.29,58.37 19.74,58.37 19.81,58.29 20.73,58.29 SH2.26
IO15
  Top 0.152: JP2.35 56.08,53.26 47.02,53.26 46.86,53.11 46.56,53.11 46.48,53.19 45.57,53.19 SH2.3
IO16
  Top 0.152: JP2.29 56.08,60.88 47.02,60.88 46.86,60.73 46.56,60.73 46.48,60.81 45.57,60.81 SH2.6
IO17
  Top 0.152: JP2.27 56.08,63.4 46.94,63.4 46.86,63.48 46.56,63.48 46.48,63.4 45.57,63.4 SH2.7
IO18
  Top 0.152: JP2.23 56.08,68.5 47.02,68.5 46.86,68.35 46.56,68.35 46.48,68.43 45.57,68.43 SH2.9
IO19
  Top 0.152: JP2.21 56.08,71.02 46.94,71.02 46.86,71.09 46.56,71.09 46.48,71.02 45.57,71.02 SH2.10
IO21
  Top 0.152: JP2.19 56.08,73.53 47.02,73.53 46.94,73.61 46.56,73.61 46.48,73.53 45.57,73.53 SH2.11
IO22
  Top 0.152: JP2.13 56.08,81.15 47.02,81.15 46.94,81.23 46.56,81.23 46.48,81.15 45.57,81.15 SH2.14
IO23
  Top 0.152: JP2.11 56.08,83.74 47.02,83.74 46.86,83.59 46.56,83.59 46.48,83.67 45.57,83.67 SH2.15
IO25
  Top 0.152: JP1.26 10.29,65.99 19.74,65.99 19.81,65.91 20.73,65.91 SH2.23
IO26
  Top 0.152: JP1.28 10.29,63.4 19.36,63.4 19.43,63.48 20.65,63.48 20.73,63.4 SH2.24
IO27
  Top 0.152: JP1.30 10.29,60.88 19.43,60.88 19.51,60.96 20.65,60.96 20.73,60.88 SH2.25
IO32
  Top 0.152: JP1.22 10.29,71.02 19.36,71.02 19.43,71.09 20.65,71.09 20.73,71.02 SH2.21
IO33
  Top 0.152: JP1.24 10.29,68.5 19.43,68.5 19.51,68.58 20.65,68.58 20.73,68.5 SH2.22
IO34
  Top 0.152: JP1.18 10.29,76.12 19.43,76.12 19.51,76.2 20.65,76.2 20.73,76.12 SH2.19
IO35
  Top 0.152: JP1.20 10.29,73.61 19.74,73.61 19.81,73.53 20.73,73.53 SH2.20
IOEN
  Top 0.152: JP1.12 10.29,83.74 19.43,83.74 19.51,83.82 20.65,83.82 20.73,83.74 SH2.16
IOGND
  Top 0.305: JP2.37 56.08,50.67 47.09,50.67 46.94,50.83 46.56,50.83 46.41,50.67 45.57,50.67 SH2.2
IOVIN
  Top 0.305: JP1.40 10.29,48.16 19.2,48.16 19.36,48.31 19.89,48.31 20.04,48.16 20.73,48.16 SH2.30
IOVN
  Top 0.152: JP1.16 10.29,78.64 19.36,78.64 19.43,78.72 20.65,78.72 20.73,78.64 SH2.18
IOVP
  Top 0.152: JP1.14 10.29,81.23 19.74,81.23 19.81,81.15 20.73,81.15 SH2.17
L2-Q1  (via drill 0.3)
  Top 0.305: 43.13,16.15 43.28,16.15 43.43,16 43.89,16 Q1.3 | 43.05,16.08 43.13,16.15 | 43.05,16.08 39.01,16.08 38.94,16 C11.2 | D1.2 43.81,21.95 43.81,17.3 42.98,16.46 42.98,16.31 43.13,16.15 | v44.73,10.36 46.02,9.07 L2.2 | v43.2,15.93 43.05,16.08
  Bottom 0.305: v44.73,10.36 44.73,14.4 v43.2,15.93
MRX  (via drill 0.3)
  Top 0.152: v73.38,63.78 73.38,55.7 76.81,52.27 76.81,51.05 SJ1.2
  Bottom 0.152: v73.38,63.78 58.6,78.56 JP2.16
MTX  (via drill 0.3)
  Top 0.152: v73.38,66.29 73.38,65.76 76.81,62.33 76.81,56.01 SJ2.2
  Bottom 0.152: v73.38,66.29 58.6,81.08 JP2.14
NC1
  Top 0.152: 58.37,13.26 62.03,13.26 62.71,13.95 62.94,13.95 TPS.TP | 58.37,13.26 58.22,13.26 J2.S1 58.37,13.26 | 58.37,13.26 58.37,25.6 58.22,25.76 58.22,26.67 J2.S2
NC2  (via drill 0.3)
  Top 0.152: v53.95,25.22 53.95,25.15 54.86,24.23 54.94,24.31 55.17,24.31 55.24,24.23 55.63,24.23 J2.4 | v49.76,25.3 49.07,25.98 NC2.TP
  Bottom 0.152: v53.95,25.22 49.84,25.22 v49.76,25.3
NC3  (via drill 0.3)
  Top 0.152: v50.83,23.62 51.28,23.16 55.63,23.16 J2.6 | v49.76,24.69 49.07,24 NC3.TP
  Bottom 0.152: v49.76,24.69 v50.83,23.62
NC4  (via drill 0.3)
  Top 0.152: v51.28,22.71 54.71,22.71 54.86,22.86 55.17,22.86 55.24,22.78 55.63,22.78 J2.7 | v49.91,21.34 49.3,21.95 49.07,21.95 NC4.TP
  Bottom 0.152: v49.91,21.34 v51.28,22.71
RESE  (via drill 0.3)
  Top 0.152: v49.61,18.75 47.55,16.69 46.1,16.69 Q1.2 | J2.3 55.7,24.77 56.08,24.77 v56.46,24.38 56.46,24.46 56.69,24.69 56.69,27.13 57,27.43 57,31.01 R1.2
  Bottom 0.152: v49.61,18.75 50.83,18.75 v56.46,24.38
RESET_COG  (via drill 0.3)
  Top 0.152: v53.65,22.25 54.63,21.26 54.79,21.26 54.86,21.34 55.17,21.34 55.24,21.26 55.63,21.26 J2.10
  Bottom 0.152: v53.65,22.25 53.65,23.01 55.32,24.69 55.32,32.16 | 55.32,32.16 55.32,47.02 54.79,47.55 54.79,56.31 55.55,57.07 56.62,57.07 56.69,57 57.23,57 58.45,58.22 58.6,58.22 JP2.32 | 55.32,32.16 19.89,32.16 6.78,19.05 5.26,19.05 5.18,19.13 3.5,19.13 2.21,17.83 J4.9
SPI_CLK_COG  (via drill 0.3)
  Top 0.152: v56.46,20.12 56.08,19.74 55.7,19.74 J2.13 | v64.92,20.57 67.13,22.78 67.51,22.78 67.82,23.09 67.82,23.93 67.97,24.08 SJ96.2
  Bottom 0.152: 59.28,20.12 64.47,20.12 v64.92,20.57 | 59.28,20.12 v56.46,20.12 | 59.28,20.12 59.28,17.91 48.08,6.71 32.38,6.71 30.18,8.91 5.26,8.91 5.18,8.84 3.5,8.84 2.21,10.13 J4.3
SPI_MISO_COG  (via drill 0.3)
  Top 0.152: v47.78,12.04 66.98,12.04 67.97,11.05 67.97,10.21 SJ98.2 | v20.8,17.07 16.31,17.07 15.85,16.61 4.42,16.61 3.35,17.68 3.35,18.97 2.21,20.12 2.21,20.27 J4.11
  Bottom 0.152: v47.78,12.04 42.75,17.07 v20.8,17.07
SPI_MOSI_COG  (via drill 0.3)
  Top 0.152: 56.58,19.24 58.06,20.73 58.06,25.45 57.23,26.29 57.23,27.2 59.89,29.87 67.44,29.87 67.74,29.57 67.74,28.19 67.97,27.96 SJ97.2 | 56.58,19.24 56.46,19.13 56.16,19.13 56.08,19.2 55.7,19.2 J2.14 | v26.82,19.36 15.24,19.36 14.94,19.05 5.26,19.05 5.18,19.13 4.42,19.13 3.35,20.19 3.35,21.64 2.82,22.17 2.82,22.25 2.21,22.86 J4.13 | v52.58,13.26 54.18,13.26 54.41,13.03 56.54,13.03 57.15,13.64 57.15,18.67 56.58,19.24
  Bottom 0.152: v26.82,19.36 42.9,19.36 49,13.26 v52.58,13.26
SRX
  Top 0.152: SJ2.1 75.29,55.93 75.29,55.17 78.33,52.12 91.97,52.12 92.13,52.27 93.19,52.27 95.94,49.53 140.21,49.53 140.36,49.68 141.43,49.68 142.26,48.84 142.26,47.17 140.82,45.72 SH1.D0
STX
  Top 0.152: SJ1.1 75.29,50.98 75.29,50.14 75.89,49.53 91.9,49.53 92.05,49.68 93.19,49.68 93.73,49.15 139.83,49.15 140.66,48.31 140.82,48.31 SH1.D1
VCC  (via drill 0.3)
  Top 0.305: v44.73,8.99 43.97,8.99 L2.1 | J2.16 55.7,18.29 55.7,18.67 J2.15 55.55,18.75 55.4,18.75 55.24,18.59 54.86,18.59 | 54.86,18.59 51.28,22.17 51.05,22.17 50.75,22.48 50.75,22.94 50.29,23.39 50.29,29.26 49.3,30.25 49.3,30.86 49.07,31.09 C2.2 48.92,31.01 48.77,30.86 47.85,30.86 46.86,29.87 43.97,29.87 42.67,31.17 41.07,31.17 C4.1 | v54.86,18.44 54.86,18.59
  Bottom 0.305: JP4.2 39.32,9.07 44.65,9.07 v44.73,8.99 44.81,9.07 49.15,9.07 55.4,15.32 55.4,17.91 v54.86,18.44
VCC_3V3  (via drill 0.3)
  Top 0.305: U1.7 29.64,11.66 29.64,12.88 U1.8 | U1.7 29.49,11.58 28.65,11.58 27.96,10.9 25.91,10.9 25.53,10.52 25.45,10.52 25.3,10.36 24.46,10.36 U1.3 24.31,10.36 23.47,10.36 23.32,10.52 23.24,10.52 22.86,10.9 19.05,10.9 C13.2 18.9,10.97 18.82,11.05 17.98,11.05 17.75,11.28 15.24,11.28 10.21,6.25 3.5,6.25 2.74,7.01 2.74,7.09 2.21,7.62 J4.1 | JP4.1 36.73,9.07 33.22,9.07 30.86,11.43 30.71,11.43 30.48,11.66 29.79,11.66 U1.7 | JP2.3 56.08,93.88 56.08,96.32 JP2.1 56.24,96.39 58.6,96.39 JP2.2 58.67,96.24 58.67,93.95 JP2.4 58.67,93.8 60.2,92.28 60.2,88.32 74.68,73.84 JP3.1 74.68,73.69 72.85,71.86 72.85,62.33 58.75,48.23 JP2.40 58.6,48.08 47.47,36.96 47.47,32.77 45.87,31.17 45.03,31.17 C3.2 44.88,31.09 44.73,30.94 43.97,30.94 v43.81,30.79 | v40.01,16.61 42.14,18.75 v42.14,25.83
  Bottom 0.305: v40.01,16.61 40.01,13.41 36.8,10.21 36.8,9.07 JP4.1 | v42.14,25.83 42.14,29.11 v43.81,30.79
VCOM  (via drill 0.3)
  Top 0.305: v19.89,30.63 20.34,31.09 20.95,31.09 C9.1 | J2.24 55.63,14.17 55.32,14.17 55.17,14.02 54.71,14.02 54.48,14.25 47.02,14.25 46.79,14.02 31.93,14.02 31.24,14.71 16.76,14.71 16.15,15.32 15.77,15.32 VCOM.TP 15.62,15.32 15.32,15.32 14.78,14.78 14.63,14.78 14.17,15.24 4.72,15.24 J4.8
  Bottom 0.305: v19.89,30.63 19.89,30.48 4.72,15.32 J4.8
VDDD
  Top 0.305: J2.18 55.63,17.22 54.86,17.22 50.29,21.79 50.29,22.55 49.76,23.09 49.68,23.09 49.61,23.16 49.45,23.16 49.38,23.09 49.3,23.09 49.23,23.01 48.69,23.01 48.54,23.16 48.39,23.16 48.31,23.09 48.23,23.09 48.16,23.01 46.41,23.01 38.56,30.86 37.26,30.86 37.03,31.09 C5.1
VDH
  Top 0.305: J4.14 4.72,22.86 5.87,22.86 6.02,22.71 14.71,22.71 15.32,23.32 15.7,23.32 VDH.TP 15.85,23.47 17.07,24.69 17.07,28.73 15.47,30.33 15.47,33.76 15.93,34.21 30.02,34.21 31.47,32.77 31.47,31.77 31.85,31.39 32.77,31.39 32.92,31.24 C6.1 33.07,31.09 33.3,30.86 34.14,30.86 35.13,29.87 38.86,29.87 48.01,20.73 50.67,20.73 55.17,16.23 55.63,16.23 J2.20
VDHR  (via drill 0.3)
  Top 0.305: J2.5 55.63,23.7 55.17,23.7 55.02,23.55 54.86,23.55 53.42,24.99 53.42,30.71 53.03,31.09 C1.2 52.88,31.17 v51.82,31.17 | J4.6 4.72,12.72 5.79,12.72 6.02,12.5 14.55,12.5 14.94,12.88 15.7,12.88 VDHR.TP 15.85,12.88 v16.54,13.56
  Bottom 0.305: v51.82,31.17 44.2,31.17 44.04,31.32 34.29,31.32 v16.54,13.56
VDL  (via drill 0.3, 0.35)
  Top 0.305: VDL.TP 15.7,18.14 15.24,18.14 v14.78,18.59 14.71,18.67 5.56,18.67 4.72,17.83 J4.10 | C8.1 24.99,31.09 v24.99,30.1 28.73,26.36 v32.26,26.36 | J2.22 51.44,15.23 v49.91,16.76 | v41.26,29.36 42.03,29.36 v43.24,28.15 | v48.81,19.83 47.35,18.37 v46.92,18.37 | v35.26,28.36 35.35,28.45 v39.5,28.45
  Bottom 0.305: v24.99,30.1 24.99,28.8 v14.78,18.59 | v41.26,29.36 40.35,28.45 v39.5,28.45 | v43.24,28.15 43.24,25.4 v48.81,19.83 | v46.92,18.37 48.53,16.76 v49.91,16.76 | v35.26,28.36 33.26,26.36 v32.26,26.36
VGH  (via drill 0.3)
  Top 0.305: 14.86,26.44 14.71,26.59 5.87,26.59 4.72,25.45 J4.16 | 14.86,26.44 15.24,26.06 15.7,26.06 VGH.TP | v41.6,21.26 40.92,21.95 40.23,21.95 D1.1 40.08,22.1 39.4,22.1 30.33,31.17 29.03,31.17 C7.2 28.88,31.17 v27.89,31.17 | v14.78,26.36 14.86,26.44 | J2.21 54.16,15.73 v53.71,16.18
  Bottom 0.305: v41.6,21.26 47.32,15.54 53.08,15.54 v53.71,16.18 | v14.78,26.36 19.58,31.17 v27.89,31.17
VGL
  Top 0.305: J2.23 55.63,14.71 55.17,14.71 55.02,14.55 54.86,14.55 54.71,14.71 46.79,14.71 46.56,14.48 32.46,14.48 25.6,21.34 24.46,21.34 23.85,21.95 D3.2 23.7,21.95 23.01,21.95 21.26,20.19 17.53,20.19 | 17.53,20.19 16.84,20.19 16.23,20.8 15.77,20.8 VGL.TP 15.62,20.8 15.32,20.8 14.78,20.27 14.63,20.27 14.55,20.34 4.72,20.34 J4.12 | 17.53,20.19 17.53,28.96 16.99,29.49 16.99,31.09 C10.1
VIN
  Top 0.305: JP3.8 77.34,66.14 79.93,63.55 92.58,63.55 SH1.VIN
VPP  (via drill 0.3)
  Top 0.305: v31.62,13.56 47.02,13.56 47.24,13.79 54.25,13.79 54.63,13.41 56.31,13.41 56.77,13.87 56.77,16.15 56.16,16.76 55.7,16.76 J2.19 | v16.54,10.67 15.93,10.06 15.77,10.06 VPP.TP
  Bottom 0.305: v31.62,13.56 19.43,13.56 v16.54,10.67 16.08,10.21 4.72,10.21 J4.4

### Text on the board
tNames: 5VIN | VCC_3V3 | 5VIN | VCC_3V3 | GND | GND | GND | GND | Careless WISPer / Jonathan Long, DJ Hansen, / Daniel Higgins, Joe Harrison / 9/19/21 rev. B